# EAGLE schematic pure_midi (EAGLE 9.6.2)

## Sheet 1 of 5: CONTROLLER
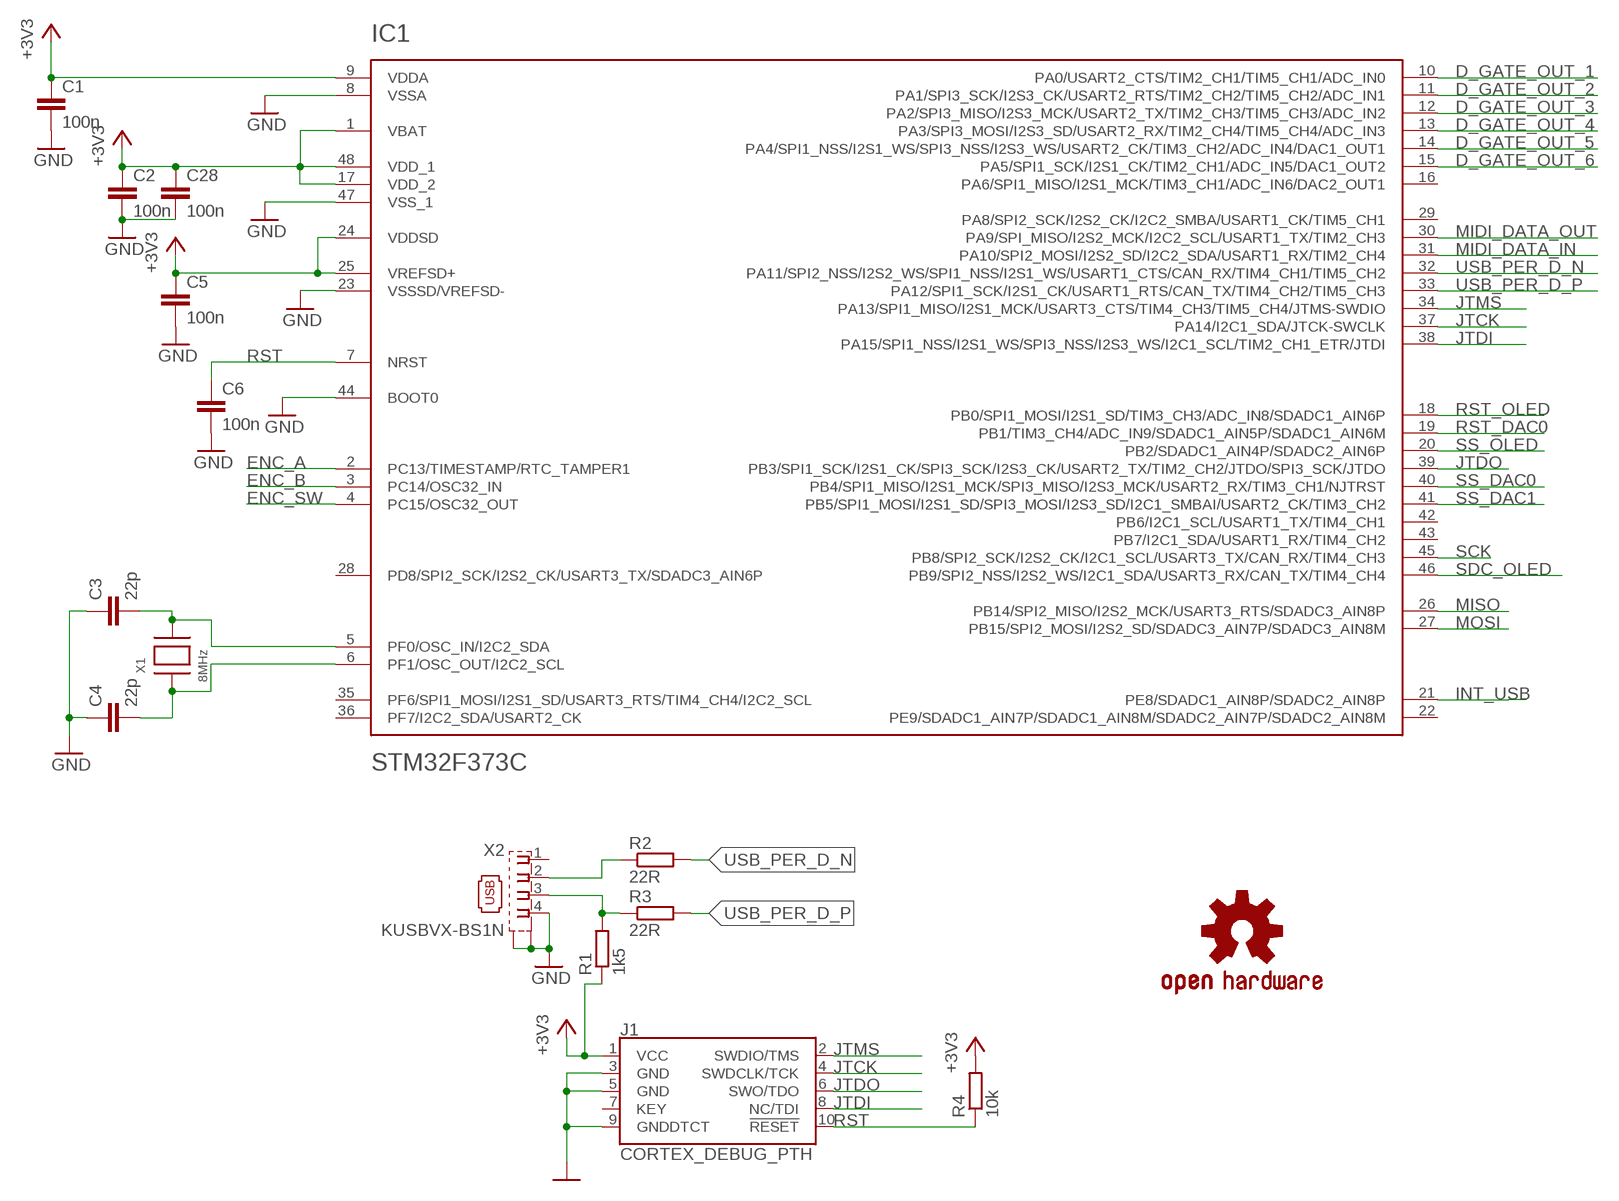
[diagram p0: schematic, sheet 1]

### Parts
C1  100n  C-EUC0603  [C0603]
C2  100n  C-EUC0603  [C0603]
C3  22p  C-EUC0603  [C0603]
C4  22p  C-EUC0603  [C0603]
C5  100n  C-EUC0603  [C0603]
C6  100n  C-EUC0603  [C0603]
C28  100n  C-EUC0603  [C0603]
IC1  STM32F373C  [LQFP48]
J1  CORTEX_DEBUG_PTH  [2X5-PTH-1.27MM]
LOGO1  OSHW-LOGOM  [OSHW-LOGO-M]
R1  1k5  R-EU_R0603  [R0603]
R2  22R  R-EU_R0603  [R0603]
R3  22R  R-EU_R0603  [R0603]
R4  10k  R-EU_R0603  [R0603]
X1  8MHz  XTALNX5032  [NX5032]
X2  KUSBVX-BS1N  [KUSBVX-BS1N]

### Nets
+3V3 [POWER]: C1.1 C2.1 C5.1 C28.1 IC1.1(VBAT) IC1.9(VDDA) IC1.17(VDD_2) IC1.24(VDDSD) IC1.25(VREFSD+) IC1.48(VDD_1) J1.1(VCC) R1.1 R4.2 ; also sheet 2,3,4,5
D_GATE_OUT_1: IC1.10(PA0/USART2_CTS/TIM2_CH1/TIM5_CH1/ADC_IN0) ; also sheet 3
D_GATE_OUT_2: IC1.11(PA1/SPI3_SCK/I2S3_CK/USART2_RTS/TIM2_CH2/TIM5_CH2/ADC_IN1) ; also sheet 3
D_GATE_OUT_3: IC1.12(PA2/SPI3_MISO/I2S3_MCK/USART2_TX/TIM2_CH3/TIM5_CH3/ADC_IN2) ; also sheet 3
D_GATE_OUT_4: IC1.13(PA3/SPI3_MOSI/I2S3_SD/USART2_RX/TIM2_CH4/TIM5_CH4/ADC_IN3) ; also sheet 3
D_GATE_OUT_5: IC1.14(PA4/SPI1_NSS/I2S1_WS/SPI3_NSS/I2S3_WS/USART2_CK/TIM3_CH2/ADC_IN4/DAC1_OUT1) ; also sheet 3
D_GATE_OUT_6: IC1.15(PA5/SPI1_SCK/I2S1_CK/TIM2_CH1/ADC_IN5/DAC1_OUT2) ; also sheet 3
ENC_A: IC1.2(PC13/TIMESTAMP/RTC_TAMPER1) ; also sheet 2
ENC_B: IC1.3(PC14/OSC32_IN) ; also sheet 2
ENC_SW: IC1.4(PC15/OSC32_OUT) ; also sheet 2
GND [POWER]: C1.2 C2.2 C3.1 C4.1 C5.2 C6.2 C28.2 IC1.8(VSSA) IC1.23(VSSSD/VREFSD-) IC1.44(BOOT0) IC1.47(VSS_1) J1.3(GND) J1.5(GND) J1.9(GNDDTCT) X2.4 X2.M1(S1) X2.M2(S2) ; also sheet 2,3,4,5
INT_USB: IC1.21(PE8/SDADC1_AIN8P/SDADC2_AIN8P)
JTCK: IC1.37(PA14/I2C1_SDA/JTCK-SWCLK) J1.4(SWDCLK/TCK)
JTDI: IC1.38(PA15/SPI1_NSS/I2S1_WS/SPI3_NSS/I2S3_WS/I2C1_SCL/TIM2_CH1_ETR/JTDI) J1.8(NC/TDI)
JTDO: IC1.39(PB3/SPI1_SCK/I2S1_CK/SPI3_SCK/I2S3_CK/USART2_TX/TIM2_CH2/JTDO/SPI3_SCK/JTDO) J1.6(SWO/TDO)
JTMS: IC1.34(PA13/SPI1_MISO/I2S1_MCK/USART3_CTS/TIM4_CH3/TIM5_CH4/JTMS-SWDIO) J1.2(SWDIO/TMS)
MIDI_DATA_IN: IC1.31(PA10/SPI2_MOSI/I2S2_SD/I2C2_SDA/USART1_RX/TIM2_CH4) ; also sheet 4
MIDI_DATA_OUT: IC1.30(PA9/SPI_MISO/I2S2_MCK/I2C2_SCL/USART1_TX/TIM2_CH3) ; also sheet 4
MISO: IC1.26(PB14/SPI2_MISO/I2S2_MCK/USART3_RTS/SDADC3_AIN8P)
MOSI: IC1.27(PB15/SPI2_MOSI/I2S2_SD/SDADC3_AIN7P/SDADC3_AIN8M) ; also sheet 2,3
N$3: C4.2 IC1.6(PF1/OSC_OUT/I2C2_SCL) X1.P$1
N$6: C3.2 IC1.5(PF0/OSC_IN/I2C2_SDA) X1.P$2
N$21: R2.1 X2.2
N$23: R1.2 R3.1 X2.3
RST: C6.1 IC1.7(NRST) J1.10(!RESET) R4.1
RST_DAC0: IC1.19(PB1/TIM3_CH4/ADC_IN9/SDADC1_AIN5P/SDADC1_AIN6M) ; also sheet 3
RST_OLED: IC1.18(PB0/SPI1_MOSI/I2S1_SD/TIM3_CH3/ADC_IN8/SDADC1_AIN6P) ; also sheet 2
SCK: IC1.45(PB8/SPI2_SCK/I2S2_CK/I2C1_SCL/USART3_TX/CAN_RX/TIM4_CH3) ; also sheet 2,3
SDC_OLED: IC1.46(PB9/SPI2_NSS/I2S2_WS/I2C1_SDA/USART3_RX/CAN_TX/TIM4_CH4) ; also sheet 2
SS_DAC0: IC1.40(PB4/SPI1_MISO/I2S1_MCK/SPI3_MISO/I2S3_MCK/USART2_RX/TIM3_CH1/NJTRST) ; also sheet 3
SS_DAC1: IC1.41(PB5/SPI1_MOSI/I2S1_SD/SPI3_MOSI/I2S3_SD/I2C1_SMBAI/USART2_CK/TIM3_CH2) ; also sheet 3
SS_OLED: IC1.20(PB2/SDADC1_AIN4P/SDADC2_AIN6P) ; also sheet 2
USB_PER_D_N: IC1.32(PA11/SPI2_NSS/I2S2_WS/SPI1_NSS/I2S1_WS/USART1_CTS/CAN_RX/TIM4_CH1/TIM5_CH2) R2.2
USB_PER_D_P: IC1.33(PA12/SPI1_SCK/I2S1_CK/USART1_RTS/CAN_TX/TIM4_CH2/TIM5_CH3) R3.2
Unconnected: IC1.16(PA6/SPI1_MISO/I2S1_MCK/TIM3_CH1/ADC_IN6/DAC2_OUT1) IC1.22(PE9/SDADC1_AIN7P/SDADC1_AIN8M/SDADC2_AIN7P/SDADC2_AIN8M) IC1.28(PD8/SPI2_SCK/I2S2_CK/USART3_TX/SDADC3_AIN6P) IC1.29(PA8/SPI2_SCK/I2S2_CK/I2C2_SMBA/USART1_CK/TIM5_CH1) IC1.35(PF6/SPI1_MOSI/I2S1_SD/USART3_RTS/TIM4_CH4/I2C2_SCL) IC1.36(PF7/I2C2_SDA/USART2_CK) IC1.42(PB6/I2C1_SCL/USART1_TX/TIM4_CH1) IC1.43(PB7/I2C1_SDA/USART1_RX/TIM4_CH2) J1.7(KEY) X2.1

## Sheet 2 of 5: UI
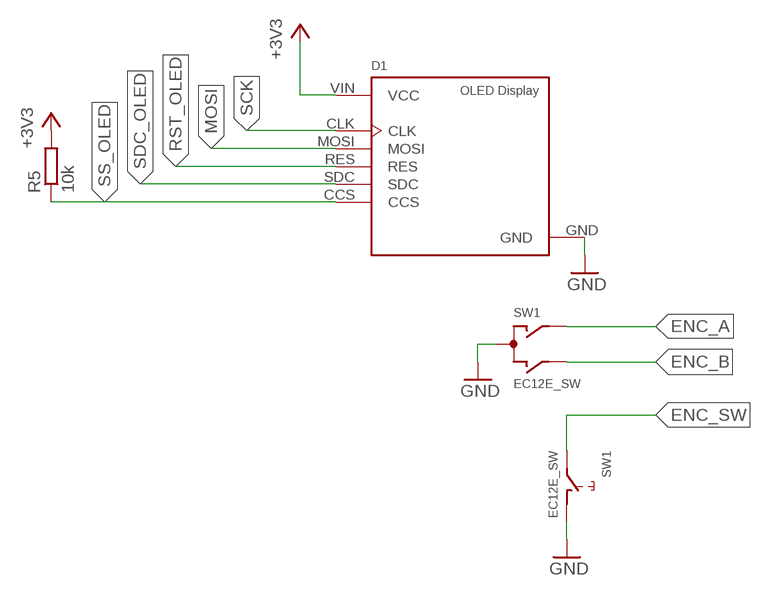
[diagram p1: schematic, sheet 2]

### Parts
D1  OLED_1.3_128X64_SPI  [C1_ADAFRUIT_1.3_128X64_OLED]
R5  10k  R-EU_R0603  [R0603]
SW1  EC12E_SW  [ALPS_EC12E_SW]

### Nets
+3V3 [POWER]: D1.VIN(VCC) R5.2 ; also sheet 1,3,4,5
ENC_A: SW1.A ; also sheet 1
ENC_B: SW1.B ; also sheet 1
ENC_SW: SW1.E ; also sheet 1
GND [POWER]: D1.GND SW1.C SW1.D ; also sheet 1,3,4,5
MOSI: D1.MOSI ; also sheet 1,3
RST_OLED: D1.RES ; also sheet 1
SCK: D1.CLK ; also sheet 1,3
SDC_OLED: D1.SDC ; also sheet 1
SS_OLED: D1.CCS R5.1 ; also sheet 1
Unconnected: SW1.GND1(G) SW1.GND2(G)

## Sheet 3 of 5: OUTPUT
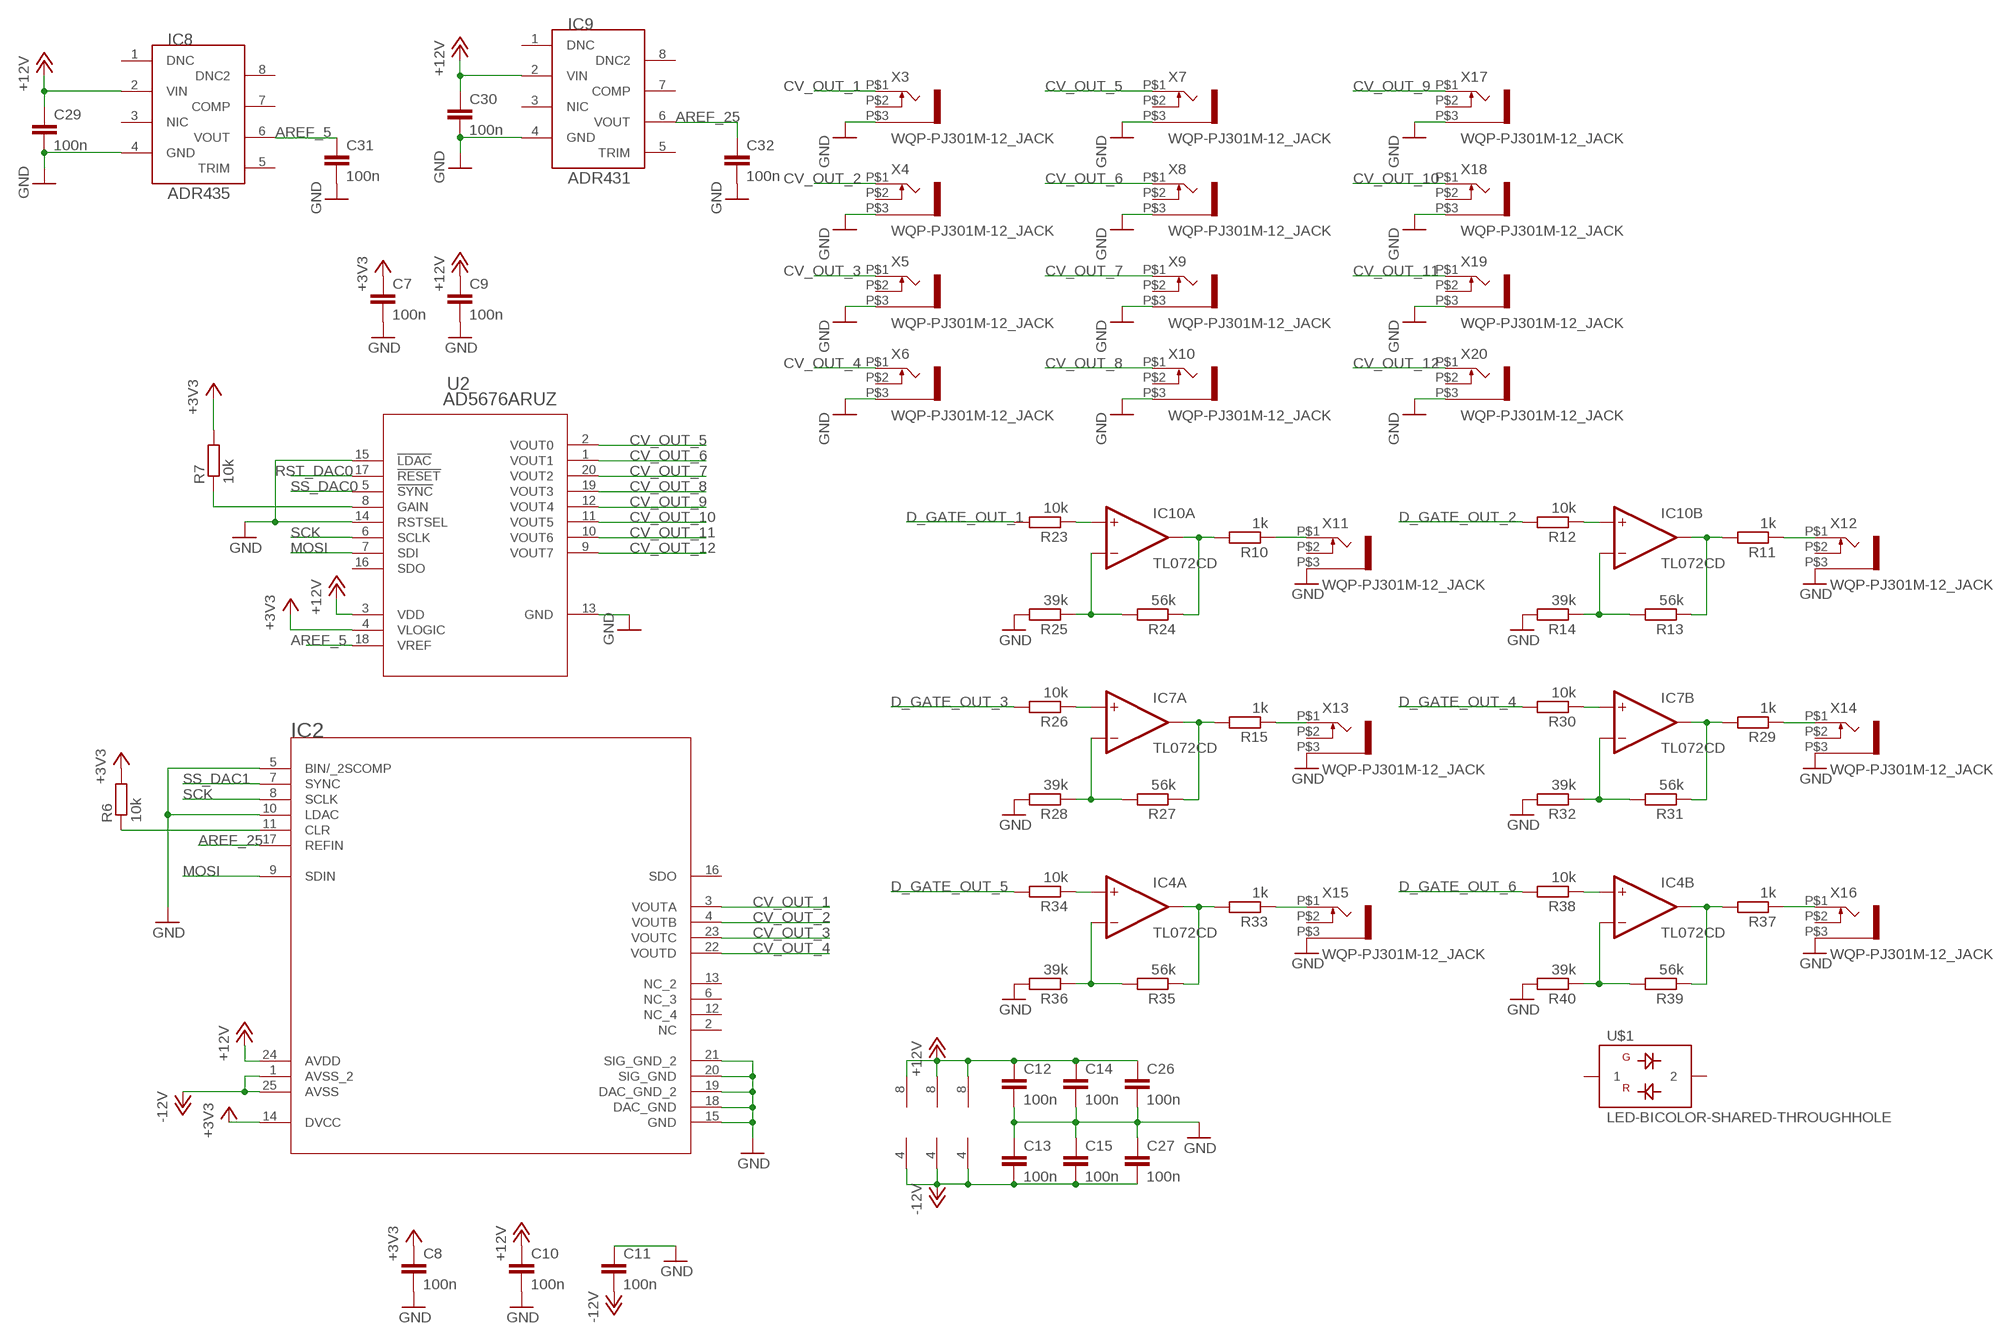
[diagram p2: schematic, sheet 3]

### Parts
C7  100n  C-EUC0603  [C0603]
C8  100n  C-EUC0603  [C0603]
C9  100n  C-EUC0603  [C0603]
C10  100n  C-EUC0603  [C0603]
C11  100n  C-EUC0603  [C0603]
C12  100n  C-EUC0603  [C0603]
C13  100n  C-EUC0603  [C0603]
C14  100n  C-EUC0603  [C0603]
C15  100n  C-EUC0603  [C0603]
C26  100n  C-EUC0603  [C0603]
C27  100n  C-EUC0603  [C0603]
C29  100n  C-EUC0603  [C0603]
C30  100n  C-EUC0603  [C0603]
C31  100n  C-EUC0603  [C0603]
C32  100n  C-EUC0603  [C0603]
IC2  AD5754BREZ  [RE_24]
IC4  TL072CD  [SOIC8]
IC7  TL072CD  [SOIC8]
IC8  ADR435  ADR43XXRMZ  [MSOP8]
IC9  ADR431  ADR43XXRMZ  [MSOP8]
IC10  TL072CD  [SOIC8]
R6  10k  R-EU_R0603  [R0603]
R7  10k  R-EU_R0603  [R0603]
R10  1k  R-EU_R0603  [R0603]
R11  1k  R-EU_R0603  [R0603]
R12  10k  R-EU_R0603  [R0603]
R13  56k  R-EU_R0603  [R0603]
R14  39k  R-EU_R0603  [R0603]
R15  1k  R-EU_R0603  [R0603]
R23  10k  R-EU_R0603  [R0603]
R24  56k  R-EU_R0603  [R0603]
R25  39k  R-EU_R0603  [R0603]
R26  10k  R-EU_R0603  [R0603]
R27  56k  R-EU_R0603  [R0603]
R28  39k  R-EU_R0603  [R0603]
R29  1k  R-EU_R0603  [R0603]
R30  10k  R-EU_R0603  [R0603]
R31  56k  R-EU_R0603  [R0603]
R32  39k  R-EU_R0603  [R0603]
R33  1k  R-EU_R0603  [R0603]
R34  10k  R-EU_R0603  [R0603]
R35  56k  R-EU_R0603  [R0603]
R36  39k  R-EU_R0603  [R0603]
R37  1k  R-EU_R0603  [R0603]
R38  10k  R-EU_R0603  [R0603]
R39  56k  R-EU_R0603  [R0603]
R40  39k  R-EU_R0603  [R0603]
U2  AD5676ARUZ  [RU_20]
U$1  LED-BICOLOR-SHARED-THROUGHHOLE  [LED3MM]
X3  WQP-PJ301M-12_JACK  [WQP-PJ301M-12_JACK]
X4  WQP-PJ301M-12_JACK  [WQP-PJ301M-12_JACK]
X5  WQP-PJ301M-12_JACK  [WQP-PJ301M-12_JACK]
X6  WQP-PJ301M-12_JACK  [WQP-PJ301M-12_JACK]
X7  WQP-PJ301M-12_JACK  [WQP-PJ301M-12_JACK]
X8  WQP-PJ301M-12_JACK  [WQP-PJ301M-12_JACK]
X9  WQP-PJ301M-12_JACK  [WQP-PJ301M-12_JACK]
X10  WQP-PJ301M-12_JACK  [WQP-PJ301M-12_JACK]
X11  WQP-PJ301M-12_JACK  [WQP-PJ301M-12_JACK]
X12  WQP-PJ301M-12_JACK  [WQP-PJ301M-12_JACK]
X13  WQP-PJ301M-12_JACK  [WQP-PJ301M-12_JACK]
X14  WQP-PJ301M-12_JACK  [WQP-PJ301M-12_JACK]
X15  WQP-PJ301M-12_JACK  [WQP-PJ301M-12_JACK]
X16  WQP-PJ301M-12_JACK  [WQP-PJ301M-12_JACK]
X17  WQP-PJ301M-12_JACK  [WQP-PJ301M-12_JACK]
X18  WQP-PJ301M-12_JACK  [WQP-PJ301M-12_JACK]
X19  WQP-PJ301M-12_JACK  [WQP-PJ301M-12_JACK]
X20  WQP-PJ301M-12_JACK  [WQP-PJ301M-12_JACK]

### Nets
+3V3 [POWER]: C7.1 C8.1 IC2.14(DVCC) R6.2 R7.2 U2.4(VLOGIC) ; also sheet 1,2,4,5
+12V [POWER]: C9.1 C10.1 C12.1 C14.1 C26.1 C29.1 C30.1 IC2.24(AVDD) IC4.8(P:V+) IC7.8(P:V+) IC8.2(VIN) IC9.2(VIN) IC10.8(P:V+) U2.3(VDD) ; also sheet 5
-12V [POWER]: C11.2 C13.2 C15.2 C27.2 IC2.1(AVSS_2) IC2.25(AVSS) IC4.4(P:V-) IC7.4(P:V-) IC10.4(P:V-) ; also sheet 5
AREF_5 [POWER]: C31.1 IC8.6(VOUT) U2.18(VREF)
AREF_25 [POWER]: C32.1 IC2.17(REFIN) IC9.6(VOUT)
CV_OUT_1: IC2.3(VOUTA) X3.P$1
CV_OUT_2: IC2.4(VOUTB) X4.P$1
CV_OUT_3: IC2.23(VOUTC) X5.P$1
CV_OUT_4: IC2.22(VOUTD) X6.P$1
CV_OUT_5: U2.2(VOUT0) X7.P$1
CV_OUT_6: U2.1(VOUT1) X8.P$1
CV_OUT_7: U2.20(VOUT2) X9.P$1
CV_OUT_8: U2.19(VOUT3) X10.P$1
CV_OUT_9: U2.12(VOUT4) X17.P$1
CV_OUT_10: U2.11(VOUT5) X18.P$1
CV_OUT_11: U2.10(VOUT6) X19.P$1
CV_OUT_12: U2.9(VOUT7) X20.P$1
D_GATE_OUT_1: R23.2 ; also sheet 1
D_GATE_OUT_2: R12.2 ; also sheet 1
D_GATE_OUT_3: R26.2 ; also sheet 1
D_GATE_OUT_4: R30.2 ; also sheet 1
D_GATE_OUT_5: R34.2 ; also sheet 1
D_GATE_OUT_6: R38.2 ; also sheet 1
GATE_OUT_1: R10.1 X11.P$1
GATE_OUT_2: R11.1 X12.P$1
GATE_OUT_3: R15.1 X13.P$1
GATE_OUT_4: R29.1 X14.P$1
GATE_OUT_6: R37.1 X16.P$1
GND [POWER]: C7.2 C8.2 C9.2 C10.2 C11.1 C12.2 C13.1 C14.2 C15.1 C26.2 C27.1 C29.2 C30.2 C31.2 C32.2 IC2.5(BIN/_2SCOMP) IC2.10(LDAC) IC2.15(GND) IC2.18(DAC_GND) IC2.19(DAC_GND_2) IC2.20(SIG_GND) IC2.21(SIG_GND_2) IC8.4(GND) IC9.4(GND) R14.2 R25.2 R28.2 R32.2 R36.2 R40.2 U2.13(GND) U2.14(RSTSEL) U2.15(!LDAC) X3.P$3 X4.P$3 X5.P$3 X6.P$3 X7.P$3 X8.P$3 X9.P$3 X10.P$3 X11.P$3 X12.P$3 X13.P$3 X14.P$3 X15.P$3 X16.P$3 X17.P$3 X18.P$3 X19.P$3 X20.P$3 ; also sheet 1,2,4,5
MOSI: IC2.9(SDIN) U2.7(SDI) ; also sheet 1,2
N$1: R7.1 U2.8(GAIN)
N$2: IC2.11(CLR) R6.1
N$10: IC10.1(A:OUT) R10.2 R24.1
N$11: IC10.7(B:OUT) R11.2 R13.1
N$14: IC10.6(B:-IN) R13.2 R14.1
N$15: IC10.5(B:+IN) R12.1
N$16: IC10.2(A:-IN) R24.2 R25.1
N$17: IC7.1(A:OUT) R15.2 R27.1
N$18: IC7.2(A:-IN) R27.2 R28.1
N$24: IC7.3(A:+IN) R26.1
N$25: IC10.3(A:+IN) R23.1
N$26: IC7.7(B:OUT) R29.2 R31.1
N$27: IC7.6(B:-IN) R31.2 R32.1
N$28: IC7.5(B:+IN) R30.1
N$29: IC4.1(A:OUT) R33.2 R35.1
N$30: IC4.2(A:-IN) R35.2 R36.1
N$31: IC4.3(A:+IN) R34.1
N$32: IC4.7(B:OUT) R37.2 R39.1
N$33: IC4.6(B:-IN) R39.2 R40.1
N$34: IC4.5(B:+IN) R38.1
N$35: R33.1 X15.P$1
RST_DAC0: U2.17(!RESET) ; also sheet 1
SCK: IC2.8(SCLK) U2.6(SCLK) ; also sheet 1,2
SS_DAC0: U2.5(!SYNC) ; also sheet 1
SS_DAC1: IC2.7(SYNC) ; also sheet 1
Unconnected: IC2.2(NC) IC2.6(NC_3) IC2.12(NC_4) IC2.13(NC_2) IC2.16(SDO) IC8.1(DNC) IC8.3(NIC) IC8.5(TRIM) IC8.7(COMP) IC8.8(DNC2) IC9.1(DNC) IC9.3(NIC) IC9.5(TRIM) IC9.7(COMP) IC9.8(DNC2) U2.16(SDO) U$1.1 U$1.2 X3.P$2 X4.P$2 X5.P$2 X6.P$2 X7.P$2 X8.P$2 X9.P$2 X10.P$2 X11.P$2 X12.P$2 X13.P$2 X14.P$2 X15.P$2 X16.P$2 X17.P$2 X18.P$2 X19.P$2 X20.P$2

## Sheet 4 of 5: MIDI
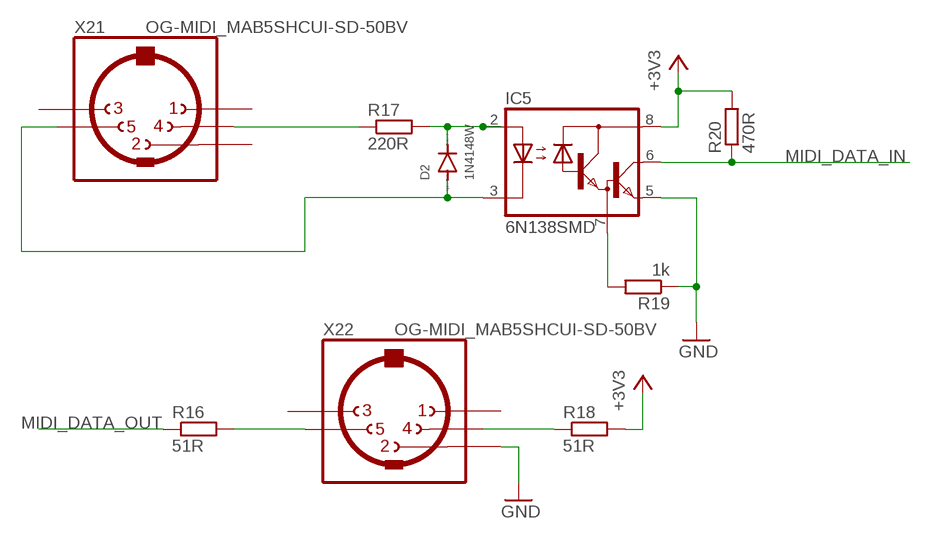
[diagram p3: schematic, sheet 4]

### Parts
D2  1N4148W  DIODE-SOD123  [SOD123]
IC5  6N138SMD  [SO8-GW300]
R16  51R  R-EU_R0603  [R0603]
R17  220R  R-EU_R0603  [R0603]
R18  51R  R-EU_R0603  [R0603]
R19  1k  R-EU_R0603  [R0603]
R20  470R  R-EU_R0603  [R0603]
X21  OG-MIDI_MAB5SHCUI-SD-50BV  [OG-MIDI_SD-50BV]
X22  OG-MIDI_MAB5SHCUI-SD-50BV  [OG-MIDI_SD-50BV]

### Nets
+3V3 [POWER]: IC5.8(VCC) R18.2 R20.2 ; also sheet 1,2,3,5
GND [POWER]: IC5.5(GND) R19.1 X22.2 ; also sheet 1,2,3,5
MIDI_DATA_IN: IC5.6(VO) R20.1 ; also sheet 1
MIDI_DATA_OUT: R16.1 ; also sheet 1
N$4: D2.C IC5.2(A) R17.2
N$5: R17.1 X21.4
N$9: D2.A IC5.3(C) X21.5
N$12: IC5.7(VB) R19.2
N$19: R16.2 X22.5
N$22: R18.1 X22.4
Unconnected: X21.1 X21.2 X21.3 X22.1 X22.3

## Sheet 5 of 5: POWER
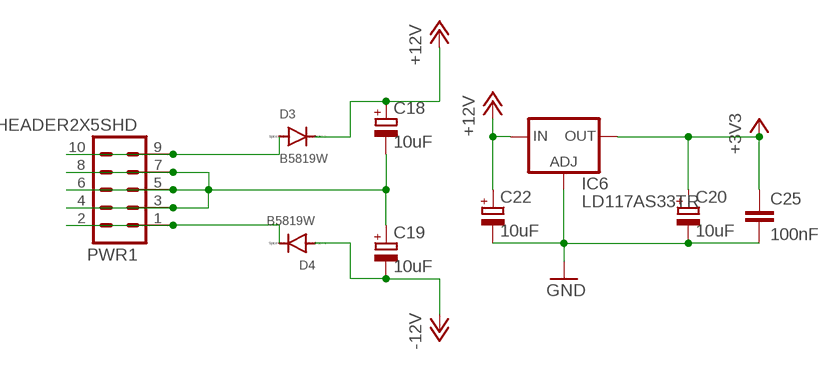
[diagram p4: schematic, sheet 5]

### Parts
C18  10uF  CPOL-EUA/3216-18R  [CASE-A_3216]
C19  10uF  CPOL-EUA/3216-18R  [CASE-A_3216]
C20  10uF  CPOL-EUA/3216-18R  [CASE-A_3216]
C22  10uF  CPOL-EUA/3216-18R  [CASE-A_3216]
C25  100nF  C-EUC0603  [C0603]
D3  B5819W  DIODE-SOD123  [SOD123]
D4  B5819W  DIODE-SOD123  [SOD123]
IC6  LD117AS33TR  [SOT223]
PWR1  HEADER2X5SHD  [2X5-SHROUDED]

### Nets
+3V3 [POWER]: C20.+ C25.1 IC6.4(OUT) ; also sheet 1,2,3,4
+12V [POWER]: C18.+ C22.+ D3.C IC6.3(IN) ; also sheet 3
-12V [POWER]: C19.- D4.A ; also sheet 3
GND [POWER]: C20.- C22.- C25.2 IC6.1(ADJ) ; also sheet 1,2,3,4
N$8 [POWER]: C18.- C19.+ PWR1.3 PWR1.4 PWR1.5 PWR1.6 PWR1.7 PWR1.8
N$13 [POWER]: D3.A PWR1.9 PWR1.10
N$20 [POWER]: D4.C PWR1.1 PWR1.2

## Library data of the parts
C1-C15 C25-C32 = jhbruhn-cdr:C-EU: CAPACITOR, European symbol; SPICEPREFIX: C
C18-C20 C22 = jhbruhn-cdr:CPOL-EU: POLARIZED CAPACITOR, European symbol; SPICEPREFIX: C
D1 = microbuilder:OLED_1.3_128X64_SPI
D2-D4 = jhbruhn-cdr:DIODE-: DIODE
IC1 = og-stm32f2:STM32F373C
IC2 = ad5754:AD5754BREZ; MANUFACTURER_PART_NUMBER: AD5754BREZ; VENDOR: Vendor
IC4 IC7 IC10 = jhbruhn-opamp:TL072: Generic Dual Op Amp
IC5 = 6n138:6N138: MOTOROLA OPTO COUPLER
IC6 = v-reg:LD117A?*: Low drop fixed and adjustable positive voltage regulators 1 A Source: http://www.st.com/stonline/products/literature/ds/7194/ld1117axx.pdf
IC8 IC9 = analog-adr43x:ADR43XXRMZ
J1 = SparkFun-Connectors:CORTEX_DEBUG: Cortex Debug Connector - 10 pin Supports JTAG debug, Serial Wire debug, and Serial Wire Viewer. PTH and SMD connector options available. General Connector Information <http://infocenter.arm.com/help/topic/com.arm.doc.faqs/attached/13634/cortex_debug_connectors.pdf> Products: PTH Connector <http://www.digikey.com/product-detail/en/cnc-tech/3220-10-0100-00/1175-1627-ND/3883661> -via Digi-Key SparkFun PSoc <https://www.sparkfun.com/products/13229> SparkFun T <https://www.sparkfun.com/products/13810>
LOGO1 = SparkFun-Aesthetics:OSHW-LOGO: Open-Source Hardware (OSHW) Logo This logo indicates the piece of hardware it is found on incorporates a OSHW license and/or adheres to the definition of open source hardware found here: http://freedomdefined.org/OSHW
PWR1 = GMSN:HEADER2X5: Header 5x2 Standard 10-pin dual row 0.1" header. Commonly used with AVR-ISP. Use with Spark Fun Electronics SKU: PRT-00778
R1-R7 R10-R20 R23-R40 = jhbruhn-cdr:R-EU_: RESISTOR, European symbol; SPICEPREFIX: R
SW1 = switch-alps:EC12E_SW: ALPS rotary Encoder EC12E series with switch; MPN: EC12E2424407; OC_FARNELL: 1520813; OC_NEWARK: 74M1068
U2 = AD5676ARUZ:AD5676ARUZ
U$1 = jhbruhn-physical:LED-BICOLOR-SHARED-THROUGHHOLE
X1 = jhbruhn-cdr:XTAL: Low cost SMT crystals, no capacitors included http://www.ladyada.net/library/eagle
X2 = con-kycon:KUSBVX-BS1N: USB B-type Receptacle Vertical, 4 Position, Through Hole Source: Sibalco Kycon KUSBVX-BS1N-xxx.pdf
X3-X20 = thonkiconn:WQP-PJ301M-12_JACK
X21 X22 = yarns_v03:OG-MIDI_MAB5SH: Female CONNECTOR 5 pins 90 deg. with shield, horizontal (DIN 41524)

## Net classes
0 default: width 0.254 mm
1 POWER: width 0.305 mm